# Altium project EFuse_PDM.PrjPcb
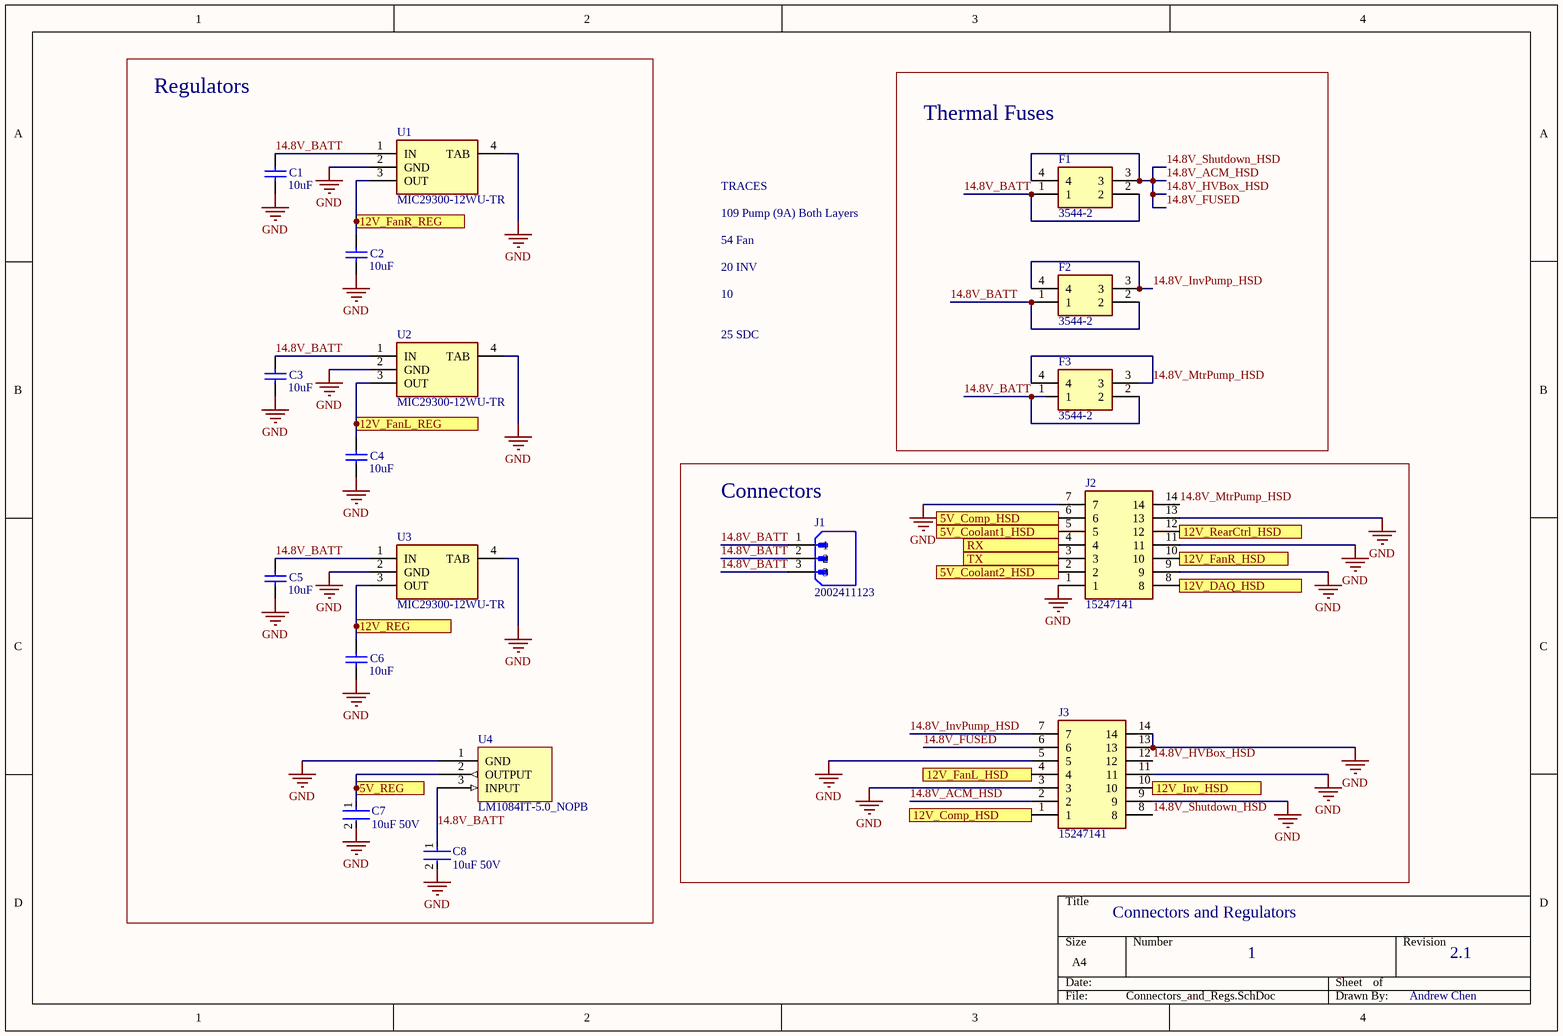
[diagram p0: Connectors_and_Regs.SchDoc]
5 sheets, 85 parts. Net scope: flat (ports and power ports of the same name join across sheets).
Board file: Efuse_PDM.PcbDoc
Sheets:
  Connectors_and_Regs.SchDoc
  Micro.SchDoc
  12V_Efuses1.SchDoc
  12V_Efuses2.SchDoc
  5V_EFuse.SchDoc

## Sheet Connectors_and_Regs.SchDoc
size A4; SheetNumber: 1; SheetTotal: 5

### Parts
C1  10uF  [C1206]
C2  10uF  [C1206]
C3  10uF  [C1206]
C4  10uF  [C1206]
C5  10uF  [C1206]
C6  10uF  [C1206]
C7  10uF 50V  [FP-CL31-IPC_A]
C8  10uF 50V  [FP-CL31-IPC_A]
F1  3544-2  [3544-2]
F2  3544-2  [3544-2]
F3  3544-2  [3544-2]
J1  2002411123  [2002411YY3_11/12/13]
J2  15247141  [MOLEX_15247141]
J3  15247141  [MOLEX_15247141]
U1  MIC29300-12WU-TR  [MIC2930012WUTR]
U2  MIC29300-12WU-TR  [MIC2930012WUTR]
U3  MIC29300-12WU-TR  [MIC2930012WUTR]
U4  LM1084IT-5.0_NOPB  [TO254P470X1028X1955-3P]

### Blocks framed on the sheet
Regulators: C1-C8 U1-U4
Thermal Fuses: F1-F3
Connectors: J1-J3

### Ports
5V_Comp_HSD, 5V_Coolant1_HSD, 5V_Coolant2_HSD, 5V_REG, 12V_Comp_HSD, 12V_DAQ_HSD, 12V_FanL_HSD, 12V_FanL_REG, 12V_FanR_HSD, 12V_FanR_REG, 12V_Inv_HSD, 12V_RearCtrl_HSD, 12V_REG, RX, TX

### Nets
GND: C1.2 C2.2 C3.2 C4.2 C5.2 C6.2 C7.2 C8.2 J2.1 J2.7 J2.9 J2.11 J2.13 J3.3 J3.5 J3.9 J3.11 J3.13 J3.14 U1.2(GND) U1.4(TAB) U2.2(GND) U2.4(TAB) U3.2(GND) U3.4(TAB) U4.1
14.8V_ACM_HSD: F1.3 F1.4 J3.2 J3.6 J3.8 J3.12  [also labelled 14.8V_FUSED, 14.8V_HVBox_HSD, 14.8V_Shutdown_HSD]
14.8V_BATT: C1.1 C3.1 C5.1 C8.1 F1.1 F1.2 F2.1 F2.2 F3.1 F3.2 J1.1 J1.2 J1.3 U1.1(IN) U2.1(IN) U3.1(IN) U4.3
14.8V_InvPump_HSD: F2.3 F2.4 J3.7
14.8V_MtrPump_HSD: F3.3 F3.4 J2.14
NetC2_1: C2.1 U1.3(OUT) ; port 12V_FanR_REG
NetC4_1: C4.1 U2.3(OUT) ; port 12V_FanL_REG
NetC6_1: C6.1 U3.3(OUT) ; port 12V_REG
NetC7_1: C7.1 U4.2 ; port 5V_REG
NetC11_1: J2.10 ; port 12V_FanR_HSD
NetC14_1: J3.4 ; port 12V_FanL_HSD
NetC20_1: J2.12 ; port 12V_RearCtrl_HSD
NetC23_1: J2.8 ; port 12V_DAQ_HSD
NetC26_1: J3.1 ; port 12V_Comp_HSD
NetC29_1: J3.10 ; port 12V_Inv_HSD
NetC31_1: J2.5 ; port 5V_Coolant1_HSD
NetC34_1: J2.2 ; port 5V_Coolant2_HSD
NetC37_1: J2.6 ; port 5V_Comp_HSD
NetJ2_3: J2.3 ; port TX
NetJ2_4: J2.4 ; port RX

### Notes on the sheet
- 109 Pump (9A) Both Layers
- 54 Fan
- TRACES
- 20 INV
- 10
- 25 SDC
- Connectors and Regulators
- 1
- 2.1
- Andrew Chen
- (in symbol LM1084IT-5.0_NOPB) GND; OUTPUT; INPUT

### Library data of the parts
C1-C6 = Cap Semi: Capacitor (Semiconductor SIM Model); Value: 100nF; Published: 8-Jun-2000; LatestRevisionDate: 29-May-2009; LatestRevisionNote: IPC-7351 Footprint Added.; PackageReference: C1206; Publisher: Altium Limited; PackageDescription: Chip Capacitor
C7 C8 = CMP-13271-002699-1: Cap Ceramic 4.7uF 16V X7R ±10% SMD 1206 +125°C Embossed T/R; Length: 0.126inch; Radiation Hardening: No; Depth: 1.6mm; Min Operating Temperature: -55°C; Mount: Surface Mount; Width: 0.063inch; Thickness: 0.071inch; Case Code (Metric): 3216; Height: 1.6mm; Capacitance: 4.7uF; Package Quantity: 1; Voltage Rating: 16V; Tolerance: 10%; Dielectric: X7R; Packaging: Tape and Reel; Case/Package: 1206; Case Code (Imperial): 1206; Max Operating Temperature: 125°C
F1-F3 = 3549-2: Fuse; Manufacturer_Name: Keystone Electronics; Datasheet Link: https://componentsearchengine.com/Datasheets/1/3549-2.pdf; Height: 5.66mm; Manufacturer_Part_Number: 3549-2; Mouser Part Number: 534-3549-2; Mouser Price/Stock: https://www.mouser.co.uk/ProductDetail/Keystone-Electronics/3549-2?qs=fP5bVVCrK%2Fei3gwwxH1JKw%3D%3D
J2 J3 = 15246142: Connector; Manufacturer_Name: Molex; Datasheet Link: https://www.molex.com/pdm_docs/sd/015246041_sd.pdf; Height: 13.6mm; Manufacturer_Part_Number: 15246142
U1-U3 = MIC29300-12WU-TR: Integrated Circuit; Manufacturer_Name: Microchip; Datasheet Link: http://www.microchip.com/mymicrochip/filehandler.aspx?ddocname=en580805; Height: 4.597mm; Manufacturer_Part_Number: MIC29300-12WU-TR; Mouser Part Number: 998-MIC29300-12WUTR; Mouser Price/Stock: https://www.mouser.co.uk/ProductDetail/Microchip-Technology-Micrel/MIC29300-12WU-TR?qs=U6T8BxXiZAUm3rpKH4l03A%3D%3D; Arrow Part Number: MIC29300-12WU-TR; Arrow Price/Stock: https://www.arrow.com/en/products/mic29300-12wu-tr/microchip-technology?region=nac
J1 = 2002411123: Availability: Unavailable; MP: 2002411123; Package: None; Value: *; Price: None

## Sheet Micro.SchDoc
size A4; SheetNumber: 2; SheetTotal: 5
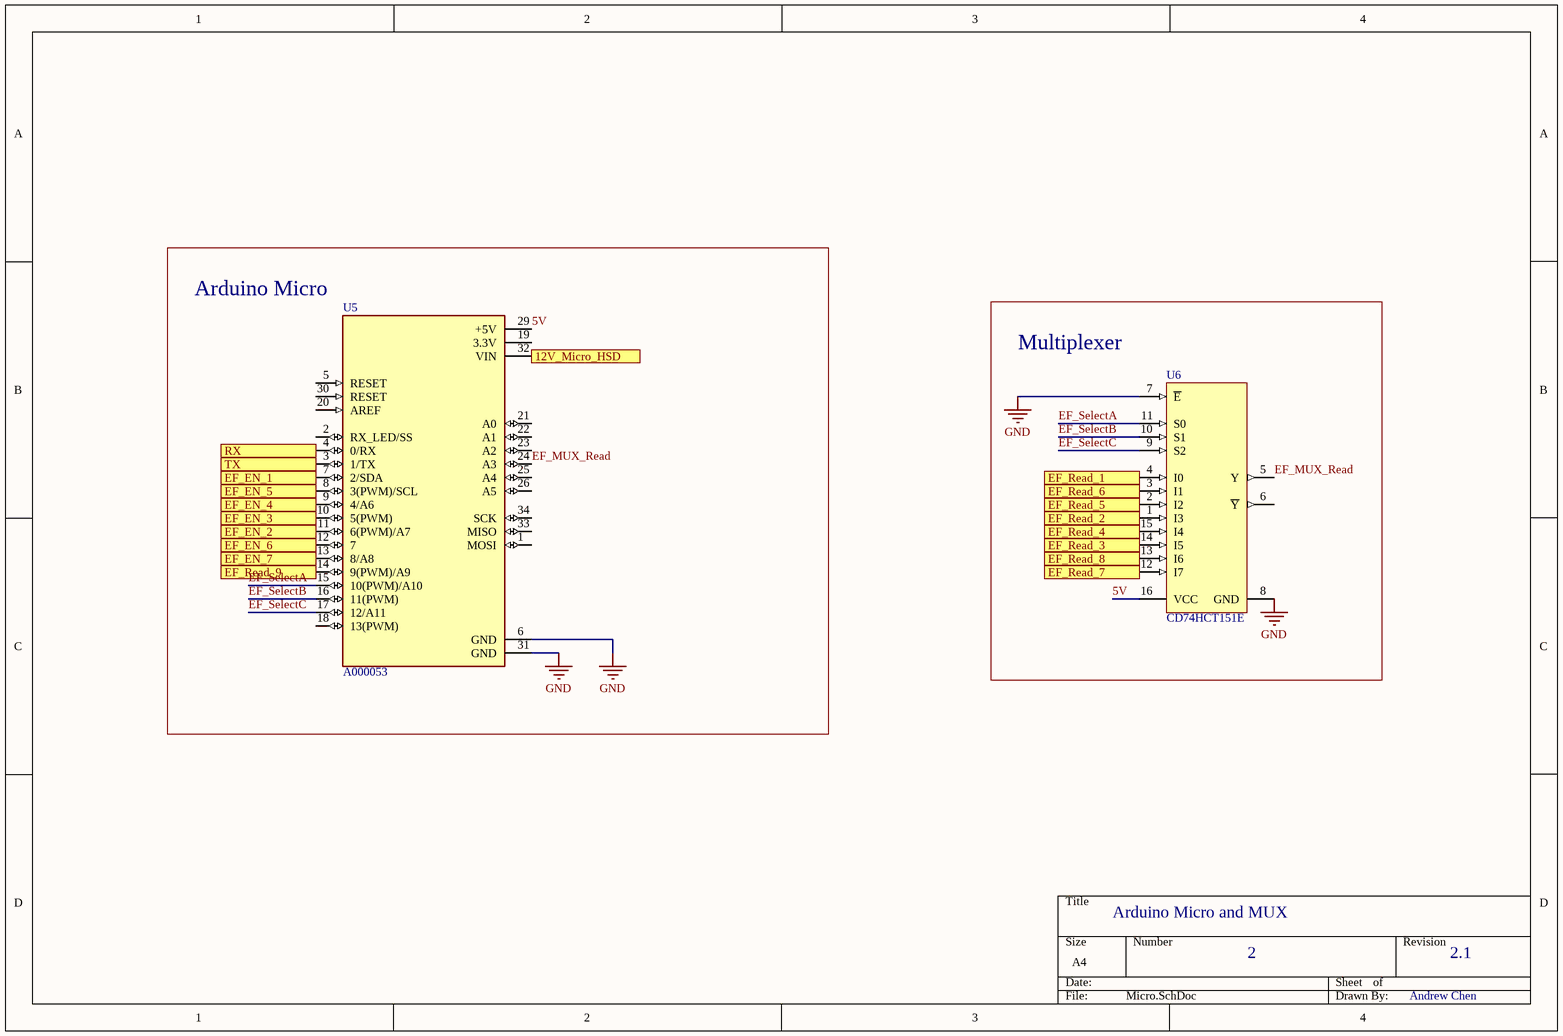
[diagram p1: Micro.SchDoc]

### Parts
U5  A000053  [ARDUINO_A000053]
U6  CD74HCT151E  [N0016A]

### Blocks framed on the sheet
Arduino Micro: U5
Multiplexer: U6

### Ports
12V_Micro_HSD, EF_EN_1, EF_EN_2, EF_EN_3, EF_EN_4, EF_EN_5, EF_EN_6, EF_EN_7, EF_Read_1, EF_Read_2, EF_Read_3, EF_Read_4, EF_Read_5, EF_Read_6, EF_Read_7, EF_Read_8, EF_Read_9, RX, TX

### Nets
GND: U5.6(GND) U5.31(GND) U6.7(~{E}) U6.8(GND)
5V: U5.29(+5V) U6.16(VCC)
EF_MUX_Read: U5.24(A3) U6.5(Y)
EF_SelectA: U5.15(10(PWM)/A10) U6.11(S0)
EF_SelectB: U5.16(11(PWM)) U6.10(S1)
EF_SelectC: U5.17(12/A11) U6.9(S2)
NetC17_1: U5.32(VIN) ; port 12V_Micro_HSD
NetC31_1: U6.12(I7) ; port EF_Read_7
NetC34_1: U6.13(I6) ; port EF_Read_8
NetC37_1: U5.14(9(PWM)/A9) ; port EF_Read_9
NetJ2_3: U5.3(1/TX) ; port TX
NetJ2_4: U5.4(0/RX) ; port RX
NetR2_2: U6.4(I0) ; port EF_Read_1
NetR5_2: U6.1(I3) ; port EF_Read_2
NetR9_2: U6.14(I5) ; port EF_Read_3
NetR12_2: U6.15(I4) ; port EF_Read_4
NetR15_2: U6.2(I2) ; port EF_Read_5
NetR18_2: U6.3(I1) ; port EF_Read_6
NetU5_7: U5.7(2/SDA) ; port EF_EN_1
NetU5_8: U5.8(3(PWM)/SCL) ; port EF_EN_5
NetU5_9: U5.9(4/A6) ; port EF_EN_4
NetU5_10: U5.10(5(PWM)) ; port EF_EN_3
NetU5_11: U5.11(6(PWM)/A7) ; port EF_EN_2
NetU5_12: U5.12(7) ; port EF_EN_6
NetU5_13: U5.13(8/A8) ; port EF_EN_7

Not connected (* = marked no-connect by the designer): U5 1(MOSI) 2(RX_LED/SS) 5(RESET) 18(13(PWM)) 19(3.3V) 20(AREF) 21(A0) 22(A1) 23(A2) 25(A4) 26(A5) 30(RESET) 33(MISO) 34(SCK); U6 6(~{Y})

### Notes on the sheet
- Arduino Micro and MUX
- 2
- 2.1
- Andrew Chen

### Library data of the parts
U5 = A000053: ATmega32U4 Arduino Micro AVRÂ® ATmega AVR MCU 8-Bit Embedded Evaluation Board; MP: A000053; SnapEDA_Link: https://www.snapeda.com/parts/A000053/Arduino/view-part/50900/?ref=snap; Digi-Key_Part_Number: 1050-1066-ND; MF: Arduino; Digi-Key_Purchase_URL: https://www.digikey.com/product-detail/en/arduino/A000053/1050-1066-ND/4486332?utm_source=snapeda&utm_medium=aggregator&utm_campaign=symbol; Package: None; Value: *
U6 = CMP-1633-00678-2: High Speed CMOS Logic 8-Input Multiplexer, N0016A, TUBE; Manufacturer: Texas Instruments; Output Drive (IOL/IOH)(Max)(mA): 4/-4; Technology Family: HCT; Input Type: TTL; F @ Nom Voltage(Max)(Mhz): 25; Rating: Catalog; Bits(#): 8; VCC(Min)(V): 4.5; VCC(Max)(V): 5.5; Schmitt Trigger: No; tpd @ Nom Voltage(Max)(ns): 48; ICC @ Nom Voltage(Max)(mA): 0.08; Channels(#): 1; Function: Encoder/Multiplexer; Configuration: 8：1; Voltage(Nom)(V): 5; Generic Part Number: CD74HCT151; PackageReference: N0016A; Output Type: CMOS; Code_JEDEC: MS-001; DatasheetVersion: SCHS150C; Type: Standard; Operating Temperature Range(C): -55 to 125

## Sheet 12V_Efuses1.SchDoc
size A4; SheetNumber: 3; SheetTotal: 5
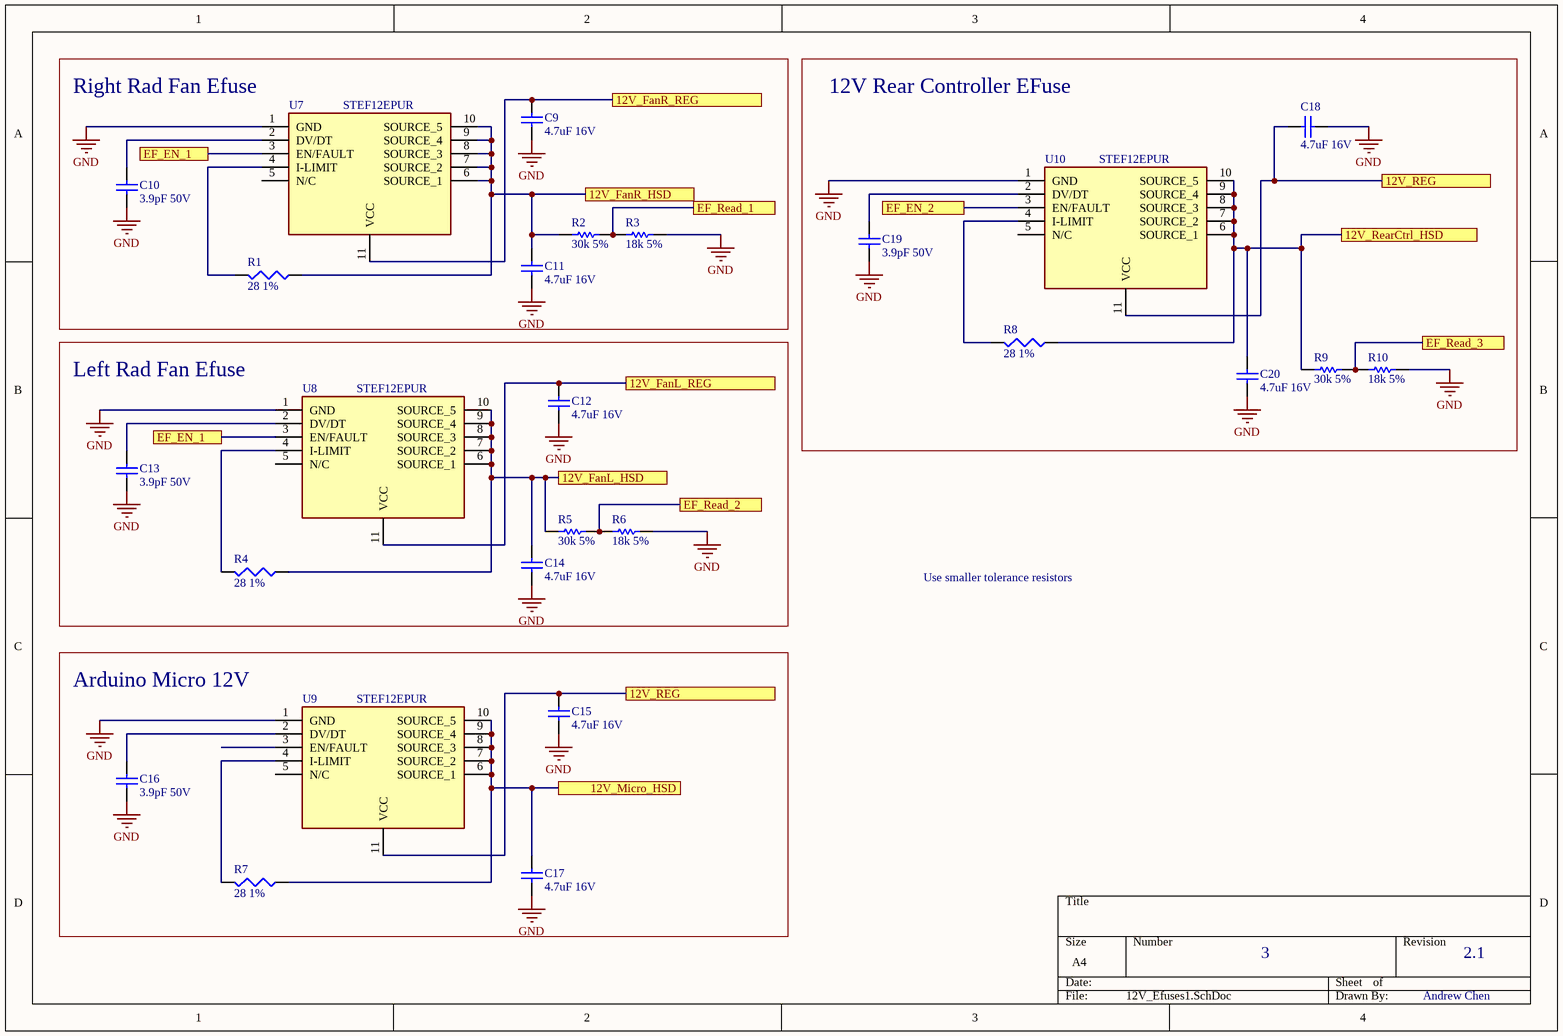
[diagram p2: 12V_Efuses1.SchDoc]

### Parts
C9  4.7uF 16V  [C1206]
C10  3.9pF 50V  [C1206]
C11  4.7uF 16V  [C1206]
C12  4.7uF 16V  [C1206]
C13  3.9pF 50V  [C1206]
C14  4.7uF 16V  [C1206]
C15  4.7uF 16V  [C1206]
C16  3.9pF 50V  [C1206]
C17  4.7uF 16V  [C1206]
C18  4.7uF 16V  [C1206]
C19  3.9pF 50V  [C1206]
C20  4.7uF 16V  [C1206]
R1  28 1%  [J1-0603]
R2  30k 5%  [RESC1609X50X30NL8T20]
R3  18k 5%  [RESC1609X50X30NL8T20]
R4  28 1%  [J1-0603]
R5  30k 5%  [RESC1609X50X30NL8T20]
R6  18k 5%  [RESC1609X50X30NL8T20]
R7  28 1%  [J1-0603]
R8  28 1%  [J1-0603]
R9  30k 5%  [RESC1609X50X30NL8T20]
R10  18k 5%  [RESC1609X50X30NL8T20]
U7  STEF12EPUR  [SON50P300X300X100-11N-D]
U8  STEF12EPUR  [SON50P300X300X100-11N-D]
U9  STEF12EPUR  [SON50P300X300X100-11N-D]
U10  STEF12EPUR  [SON50P300X300X100-11N-D]

### Blocks framed on the sheet
Right Rad Fan Efuse: C9-C11 R1-R3 U7
12V Rear Controller EFuse: C18-C20 R8-R10 U10
Left Rad Fan Efuse: C12-C14 R4-R6 U8
Arduino Micro 12V: C15-C17 R7 U9

### Ports
12V_FanL_HSD, 12V_FanL_REG, 12V_FanR_HSD, 12V_FanR_REG, 12V_Micro_HSD, 12V_RearCtrl_HSD, 12V_REG, EF_EN_1, EF_EN_2, EF_Read_1, EF_Read_2, EF_Read_3

### Nets
GND: C9.2 C10.2 C11.2 C12.2 C13.2 C14.2 C15.2 C16.2 C17.2 C18.1 C19.2 C20.2 R3.2 R6.2 R10.2 U7.1(GND) U8.1(GND) U9.1(GND) U10.1(GND)
NetC2_1: C9.1 U7.11(VCC) ; port 12V_FanR_REG
NetC4_1: C12.1 U8.11(VCC) ; port 12V_FanL_REG
NetC6_1: C15.1 C18.2 U9.11(VCC) U10.11(VCC) ; port 12V_REG
NetC10_1: C10.1 U7.2(DV/DT)
NetC11_1: C11.1 R1.1 R2.1 U7.6(SOURCE_1) U7.7(SOURCE_2) U7.8(SOURCE_3) U7.9(SOURCE_4) U7.10(SOURCE_5) ; port 12V_FanR_HSD
NetC13_1: C13.1 U8.2(DV/DT)
NetC14_1: C14.1 R4.1 R5.1 U8.6(SOURCE_1) U8.7(SOURCE_2) U8.8(SOURCE_3) U8.9(SOURCE_4) U8.10(SOURCE_5) ; port 12V_FanL_HSD
NetC16_1: C16.1 U9.2(DV/DT)
NetC17_1: C17.1 R7.1 U9.6(SOURCE_1) U9.7(SOURCE_2) U9.8(SOURCE_3) U9.9(SOURCE_4) U9.10(SOURCE_5) ; port 12V_Micro_HSD
NetC19_1: C19.1 U10.2(DV/DT)
NetC20_1: C20.1 R8.1 R9.1 U10.6(SOURCE_1) U10.7(SOURCE_2) U10.8(SOURCE_3) U10.9(SOURCE_4) U10.10(SOURCE_5) ; port 12V_RearCtrl_HSD
NetR1_2: R1.2 U7.4(I-LIMIT)
NetR2_2: R2.2 R3.1 ; port EF_Read_1
NetR4_2: R4.2 U8.4(I-LIMIT)
NetR5_2: R5.2 R6.1 ; port EF_Read_2
NetR7_2: R7.2 U9.4(I-LIMIT)
NetR8_2: R8.2 U10.4(I-LIMIT)
NetR9_2: R9.2 R10.1 ; port EF_Read_3
NetU5_7: U7.3(EN/FAULT) U8.3(EN/FAULT) ; port EF_EN_1
NetU5_11: U10.3(EN/FAULT) ; port EF_EN_2

Not connected (* = marked no-connect by the designer): U7 5(N/C); U8 5(N/C); U9 3(EN/FAULT) 5(N/C); U10 5(N/C)

### Notes on the sheet
- Use smaller tolerance resistors
- 3
- 2.1
- Andrew Chen

### Library data of the parts
C9-C20 = Cap Semi: Capacitor (Semiconductor SIM Model); Value: 22pF; Published: 8-Jun-2000; LatestRevisionDate: 29-May-2009; LatestRevisionNote: IPC-7351 Footprint Added.; PackageReference: C1206; Publisher: Altium Limited; PackageDescription: Chip Capacitor
R1 R4 R7 R8 = Res3: Resistor; Value: 220; Published: 8-Jun-2000; LatestRevisionDate: 29-May-2009; LatestRevisionNote: IPC-7351 Footprint Added.; PackageReference: J1-0603; Publisher: Altium Limited; PackageDescription: Chip Resistor
R2 R3 R5 R6 R9 R10 = CMP-2000-03816-5: CRCW06030000Z0EA; Manufacturer: Vishay Semiconductor; Voltage Rating: 75 V; Package Quantity: 5000; DatasheetVersion: 06/2012; Min Operating Temperature: -55 degC; ComponentLink1URL: http://www.vishay.com/; Mounting Technology: Surface Mount; Height: 0.45 mm; ComponentLink1Description: Manufacturer URL; REACH SVHC: Unknown; PackageReference: 0603; Packaging: Tape and Reel; Max Operating Temperature: 155 degC; Mount: Surface Mount; ComponentLink2Description: Datasheet; PackageDescription: 2-Pin Surface Mount Device, Body 1.575 x 0.85 mm; Length: 1.55 mm; ComponentLink2URL: http://www.vishay.com/docs/20035/dcrcwe3.pdf; Pins: 2; RoHSCompliant: true
U7-U10 = STEF12EPUR: Integrated Circuit; Manufacturer_Name: STMicroelectronics; Datasheet Link: https://www.arrow.com/en/products/stef12epur/stmicroelectronics; Height: 1mm; Manufacturer_Part_Number: STEF12EPUR; Mouser Part Number: 511-STEF12EPUR; Mouser Price/Stock: https://www.mouser.co.uk/ProductDetail/STMicroelectronics/STEF12EPUR?qs=mKNKSX85ZJfL9n%252BG1BPmuw%3D%3D; Arrow Part Number: STEF12EPUR; Arrow Price/Stock: https://www.arrow.com/en/products/stef12epur/stmicroelectronics

## Sheet 12V_Efuses2.SchDoc
size A4; SheetNumber: 4; SheetTotal: 5
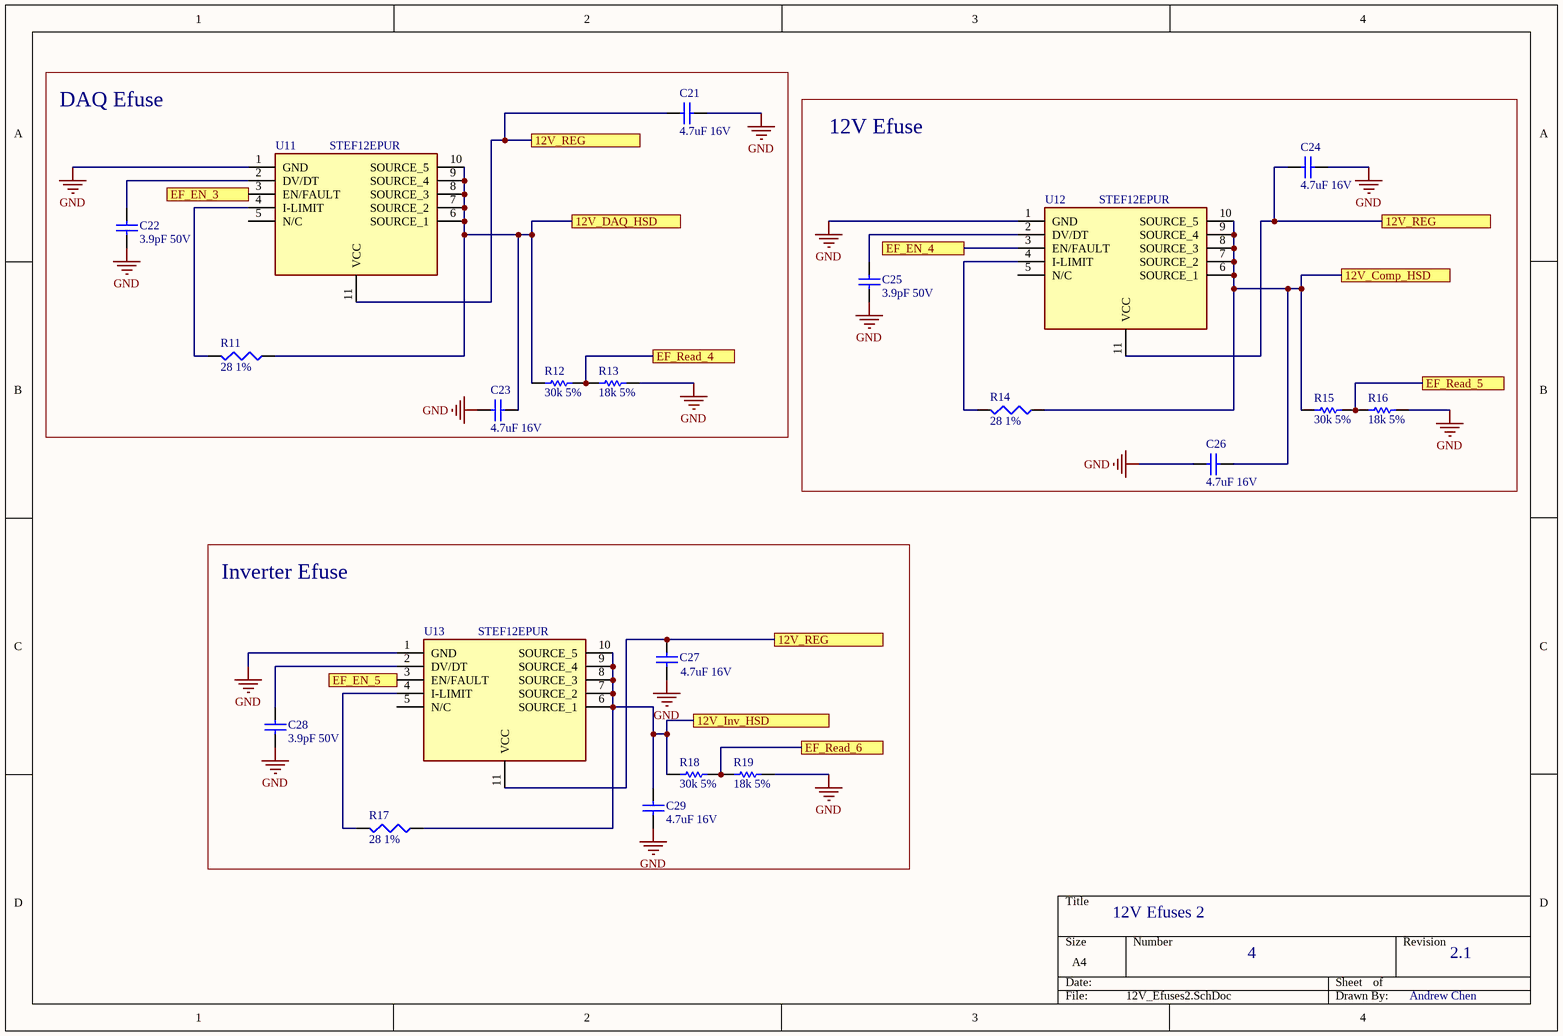
[diagram p3: 12V_Efuses2.SchDoc]

### Parts
C21  4.7uF 16V  [C1206]
C22  3.9pF 50V  [C1206]
C23  4.7uF 16V  [C1206]
C24  4.7uF 16V  [C1206]
C25  3.9pF 50V  [C1206]
C26  4.7uF 16V  [C1206]
C27  4.7uF 16V  [C1206]
C28  3.9pF 50V  [C1206]
C29  4.7uF 16V  [C1206]
R11  28 1%  [J1-0603]
R12  30k 5%  [RESC1609X50X30NL8T20]
R13  18k 5%  [RESC1609X50X30NL8T20]
R14  28 1%  [J1-0603]
R15  30k 5%  [RESC1609X50X30NL8T20]
R16  18k 5%  [RESC1609X50X30NL8T20]
R17  28 1%  [J1-0603]
R18  30k 5%  [RESC1609X50X30NL8T20]
R19  18k 5%  [RESC1609X50X30NL8T20]
U11  STEF12EPUR  [SON50P300X300X100-11N-D]
U12  STEF12EPUR  [SON50P300X300X100-11N-D]
U13  STEF12EPUR  [SON50P300X300X100-11N-D]

### Blocks framed on the sheet
DAQ Efuse: C21-C23 R11-R13 U11
12V Efuse: C24-C26 R14-R16 U12
Inverter Efuse: C27-C29 R17-R19 U13

### Ports
12V_Comp_HSD, 12V_DAQ_HSD, 12V_Inv_HSD, 12V_REG, EF_EN_3, EF_EN_4, EF_EN_5, EF_Read_4, EF_Read_5, EF_Read_6

### Nets
GND: C21.1 C22.2 C23.2 C24.1 C25.2 C26.2 C27.2 C28.2 C29.2 R13.2 R16.2 R19.2 U11.1(GND) U12.1(GND) U13.1(GND)
NetC6_1: C21.2 C24.2 C27.1 U11.11(VCC) U12.11(VCC) U13.11(VCC) ; port 12V_REG
NetC22_1: C22.1 U11.2(DV/DT)
NetC23_1: C23.1 R11.1 R12.1 U11.6(SOURCE_1) U11.7(SOURCE_2) U11.8(SOURCE_3) U11.9(SOURCE_4) U11.10(SOURCE_5) ; port 12V_DAQ_HSD
NetC25_1: C25.1 U12.2(DV/DT)
NetC26_1: C26.1 R14.1 R15.1 U12.6(SOURCE_1) U12.7(SOURCE_2) U12.8(SOURCE_3) U12.9(SOURCE_4) U12.10(SOURCE_5) ; port 12V_Comp_HSD
NetC28_1: C28.1 U13.2(DV/DT)
NetC29_1: C29.1 R17.1 R18.1 U13.6(SOURCE_1) U13.7(SOURCE_2) U13.8(SOURCE_3) U13.9(SOURCE_4) U13.10(SOURCE_5) ; port 12V_Inv_HSD
NetR11_2: R11.2 U11.4(I-LIMIT)
NetR12_2: R12.2 R13.1 ; port EF_Read_4
NetR14_2: R14.2 U12.4(I-LIMIT)
NetR15_2: R15.2 R16.1 ; port EF_Read_5
NetR17_2: R17.2 U13.4(I-LIMIT)
NetR18_2: R18.2 R19.1 ; port EF_Read_6
NetU5_8: U13.3(EN/FAULT) ; port EF_EN_5
NetU5_9: U12.3(EN/FAULT) ; port EF_EN_4
NetU5_10: U11.3(EN/FAULT) ; port EF_EN_3

Not connected (* = marked no-connect by the designer): U11 5(N/C); U12 5(N/C); U13 5(N/C)

### Notes on the sheet
- 12V Efuses 2
- 4
- 2.1
- Andrew Chen

### Library data of the parts
C21-C29 = Cap Semi: as C9 on sheet 12V_Efuses1; Published: 8-Jun-2000; LatestRevisionDate: 29-May-2009; LatestRevisionNote: IPC-7351 Footprint Added.; PackageReference: C1206; Publisher: Altium Limited; PackageDescription: Chip Capacitor
R11 R14 R17 = Res3: Resistor; Value: 220; Published: 8-Jun-2000; LatestRevisionDate: 29-May-2009; LatestRevisionNote: IPC-7351 Footprint Added.; PackageReference: J1-0603; Publisher: Altium Limited; PackageDescription: Chip Resistor
R12 R13 R15 R16 R18 R19 = CMP-2000-03816-5: as R2 on sheet 12V_Efuses1; Package Quantity: 5000; DatasheetVersion: 06/2012; Min Operating Temperature: -55 degC; ComponentLink1URL: http://www.vishay.com/; Mounting Technology: Surface Mount; Height: 0.45 mm; ComponentLink1Description: Manufacturer URL; REACH SVHC: Unknown; PackageReference: 0603; Packaging: Tape and Reel; Max Operating Temperature: 155 degC; Mount: Surface Mount; ComponentLink2Description: Datasheet; PackageDescription: 2-Pin Surface Mount Device, Body 1.575 x 0.85 mm; Length: 1.55 mm; ComponentLink2URL: http://www.vishay.com/docs/20035/dcrcwe3.pdf; Pins: 2; RoHSCompliant: true
U11-U13 = STEF12EPUR: as U7 on sheet 12V_Efuses1; Datasheet Link: https://www.arrow.com/en/products/stef12epur/stmicroelectronics; Height: 1mm; Manufacturer_Part_Number: STEF12EPUR; Mouser Part Number: 511-STEF12EPUR; Mouser Price/Stock: https://www.mouser.co.uk/ProductDetail/STMicroelectronics/STEF12EPUR?qs=mKNKSX85ZJfL9n%252BG1BPmuw%3D%3D; Arrow Part Number: STEF12EPUR; Arrow Price/Stock: https://www.arrow.com/en/products/stef12epur/stmicroelectronics

## Sheet 5V_EFuse.SchDoc
size A4; SheetNumber: 5; SheetTotal: 5
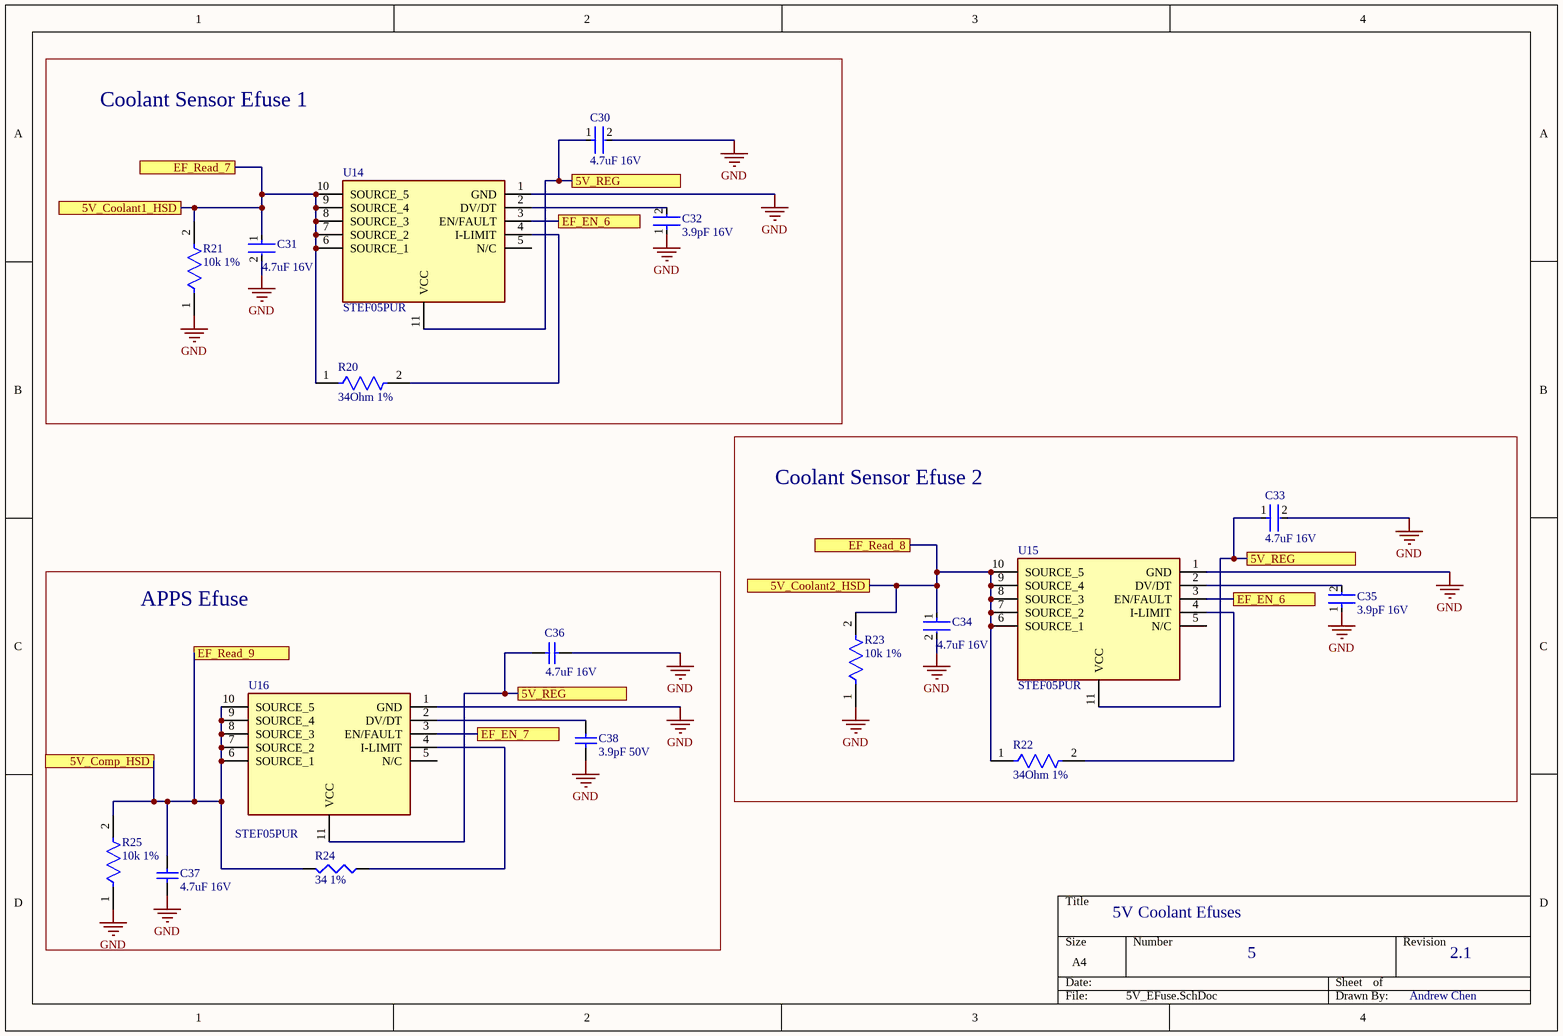
[diagram p4: 5V_EFuse.SchDoc]

### Parts
C30  4.7uF 16V  [FP-CL31-IPC_A]
C31  4.7uF 16V  [FP-CL31-IPC_A]
C32  3.9pF 16V  [FP-CL31-IPC_A]
C33  4.7uF 16V  [FP-CL31-IPC_A]
C34  4.7uF 16V  [FP-CL31-IPC_A]
C35  3.9pF 16V  [FP-CL31-IPC_A]
C36  4.7uF 16V  [C1206]
C37  4.7uF 16V  [C1206]
C38  3.9pF 50V  [C1206]
R20  34Ohm 1%  [FP-CRCW0603-e3-IPC_B]
R21  10k 1%  [FP-CRCW0603-e3-IPC_B]
R22  34Ohm 1%  [FP-CRCW0603-e3-IPC_B]
R23  10k 1%  [FP-CRCW0603-e3-IPC_B]
R24  34 1%  [J1-0603]
R25  10k 1%  [FP-CRCW0603-e3-IPC_B]
U14  STEF05PUR  [SON50P300X300X100-11N-D]
U15  STEF05PUR  [SON50P300X300X100-11N-D]
U16  STEF05PUR  [SON50P300X300X100-11N-D]

### Blocks framed on the sheet
Coolant Sensor Efuse 1: C30-C32 R20 R21 U14
Coolant Sensor Efuse 2: C33-C35 R22 R23 U15
APPS Efuse: C36-C38 R24 R25 U16

### Ports
5V_Comp_HSD, 5V_Coolant1_HSD, 5V_Coolant2_HSD, 5V_REG, EF_EN_6, EF_EN_7, EF_Read_7, EF_Read_8, EF_Read_9

### Nets
GND: C30.2 C31.2 C32.1 C33.2 C34.2 C35.1 C36.2 C37.2 C38.2 R21.1 R23.1 R25.1 U14.1(GND) U15.1(GND) U16.1(GND)
NetC7_1: C30.1 C33.1 C36.1 U14.11(VCC) U15.11(VCC) U16.11(VCC) ; port 5V_REG
NetC31_1: C31.1 R20.1 R21.2 U14.6(SOURCE_1) U14.7(SOURCE_2) U14.8(SOURCE_3) U14.9(SOURCE_4) U14.10(SOURCE_5) ; port EF_Read_7, port 5V_Coolant1_HSD
NetC32_2: C32.2 U14.2(DV/DT)
NetC34_1: C34.1 R22.1 R23.2 U15.6(SOURCE_1) U15.7(SOURCE_2) U15.8(SOURCE_3) U15.9(SOURCE_4) U15.10(SOURCE_5) ; port EF_Read_8, port 5V_Coolant2_HSD
NetC35_2: C35.2 U15.2(DV/DT)
NetC37_1: C37.1 R24.2 R25.2 U16.6(SOURCE_1) U16.7(SOURCE_2) U16.8(SOURCE_3) U16.9(SOURCE_4) U16.10(SOURCE_5) ; port EF_Read_9, port 5V_Comp_HSD
NetC38_1: C38.1 U16.2(DV/DT)
NetR20_2: R20.2 U14.4(I-LIMIT)
NetR22_2: R22.2 U15.4(I-LIMIT)
NetR24_1: R24.1 U16.4(I-LIMIT)
NetU5_12: U14.3(EN/FAULT) U15.3(EN/FAULT) ; port EF_EN_6
NetU5_13: U16.3(EN/FAULT) ; port EF_EN_7

Not connected (* = marked no-connect by the designer): U14 5(N/C); U15 5(N/C); U16 5(N/C)

### Notes on the sheet
- 5V Coolant Efuses
- 5
- 2.1
- Andrew Chen

### Library data of the parts
C30-C35 = CMP-13271-002699-1: as C7 on sheet Connectors_and_Regs; Length: 0.126inch; Radiation Hardening: No; Depth: 1.6mm; Min Operating Temperature: -55°C; Mount: Surface Mount; Width: 0.063inch; Thickness: 0.071inch; Case Code (Metric): 3216; Height: 1.6mm; Capacitance: 4.7uF; Package Quantity: 1; Voltage Rating: 16V; Tolerance: 10%; Dielectric: X7R; Packaging: Tape and Reel; Case/Package: 1206; Case Code (Imperial): 1206; Max Operating Temperature: 125°C
C36-C38 = Cap Semi: as C9 on sheet 12V_Efuses1; Published: 8-Jun-2000; LatestRevisionDate: 29-May-2009; LatestRevisionNote: IPC-7351 Footprint Added.; PackageReference: C1206; Publisher: Altium Limited; PackageDescription: Chip Capacitor
R20-R23 R25 = CMP-02407-002818-1: RES Thick Film, 18Ω, 1%, 0.1W, 100ppm/°C, 0603; Power Rating: 100mW; Voltage Rating: 75V; Resistance: 18R; Number of Pins: 2; Lead Free: Lead Free; Packaging: Tape and Reel; Tolerance: 1%; Package Quantity: 10; Temperature Coefficient: 100ppm/°C; Features: Automotive AEC-Q200; Depth: 0.85mm; Max Operating Temperature: 155°C; Min Operating Temperature: -55°C; Height: 0.45mm; Length: 1.55mm; Case Code (Metric): 1608; Radiation Hardening: No; Case Code (Imperial): 0603; Termination: SMD/SMT; Mount: Surface Mount; Composition: Thick Film; Max Power Dissipation: 100mW; Weight: 7.1E-05oz; Voltage Rating (DC): 75V; Number of Terminations: 2; Contact Plating: Tin; Width: 0.033inch; Military Standard: Not; Case/Package: 0603
R24 = Res3: Resistor; Value: 220; Published: 8-Jun-2000; LatestRevisionDate: 29-May-2009; LatestRevisionNote: IPC-7351 Footprint Added.; PackageReference: J1-0603; Publisher: Altium Limited; PackageDescription: Chip Resistor
U14-U16 = STEF12EPUR: as U7 on sheet 12V_Efuses1; Datasheet Link: https://www.arrow.com/en/products/stef12epur/stmicroelectronics; Height: 1mm; Manufacturer_Part_Number: STEF12EPUR; Mouser Part Number: 511-STEF12EPUR; Mouser Price/Stock: https://www.mouser.co.uk/ProductDetail/STMicroelectronics/STEF12EPUR?qs=mKNKSX85ZJfL9n%252BG1BPmuw%3D%3D; Arrow Part Number: STEF12EPUR; Arrow Price/Stock: https://www.arrow.com/en/products/stef12epur/stmicroelectronics

## Nets that join several sheets
GND: Connectors_and_Regs (26 pins), Micro (U5.6 U5.31 U6.7 U6.8), 12V_Efuses1 (19 pins), 12V_Efuses2 (15 pins), 5V_EFuse (15 pins)
NetC2_1: Connectors_and_Regs (C2.1 U1.3), 12V_Efuses1 (C9.1 U7.11)
NetC4_1: Connectors_and_Regs (C4.1 U2.3), 12V_Efuses1 (C12.1 U8.11)
NetC6_1: Connectors_and_Regs (C6.1 U3.3), 12V_Efuses1 (C15.1 C18.2 U9.11 U10.11), 12V_Efuses2 (6 pins)
NetC7_1: Connectors_and_Regs (C7.1 U4.2), 5V_EFuse (6 pins)
NetC11_1: Connectors_and_Regs (J2.10), 12V_Efuses1 (8 pins)
NetC14_1: Connectors_and_Regs (J3.4), 12V_Efuses1 (8 pins)
NetC17_1: Micro (U5.32), 12V_Efuses1 (7 pins)
NetC20_1: Connectors_and_Regs (J2.12), 12V_Efuses1 (8 pins)
NetC23_1: Connectors_and_Regs (J2.8), 12V_Efuses2 (8 pins)
NetC26_1: Connectors_and_Regs (J3.1), 12V_Efuses2 (8 pins)
NetC29_1: Connectors_and_Regs (J3.10), 12V_Efuses2 (8 pins)
NetC31_1: Connectors_and_Regs (J2.5), Micro (U6.12), 5V_EFuse (8 pins)
NetC34_1: Connectors_and_Regs (J2.2), Micro (U6.13), 5V_EFuse (8 pins)
NetC37_1: Connectors_and_Regs (J2.6), Micro (U5.14), 5V_EFuse (8 pins)
NetJ2_3: Connectors_and_Regs (J2.3), Micro (U5.3)
NetJ2_4: Connectors_and_Regs (J2.4), Micro (U5.4)
NetR2_2: Micro (U6.4), 12V_Efuses1 (R2.2 R3.1)
NetR5_2: Micro (U6.1), 12V_Efuses1 (R5.2 R6.1)
NetR9_2: Micro (U6.14), 12V_Efuses1 (R9.2 R10.1)
NetR12_2: Micro (U6.15), 12V_Efuses2 (R12.2 R13.1)
NetR15_2: Micro (U6.2), 12V_Efuses2 (R15.2 R16.1)
NetR18_2: Micro (U6.3), 12V_Efuses2 (R18.2 R19.1)
NetU5_7: Micro (U5.7), 12V_Efuses1 (U7.3 U8.3)
NetU5_8: Micro (U5.8), 12V_Efuses2 (U13.3)
NetU5_9: Micro (U5.9), 12V_Efuses2 (U12.3)
NetU5_10: Micro (U5.10), 12V_Efuses2 (U11.3)
NetU5_11: Micro (U5.11), 12V_Efuses1 (U10.3)
NetU5_12: Micro (U5.12), 5V_EFuse (U14.3 U15.3)
NetU5_13: Micro (U5.13), 5V_EFuse (U16.3)